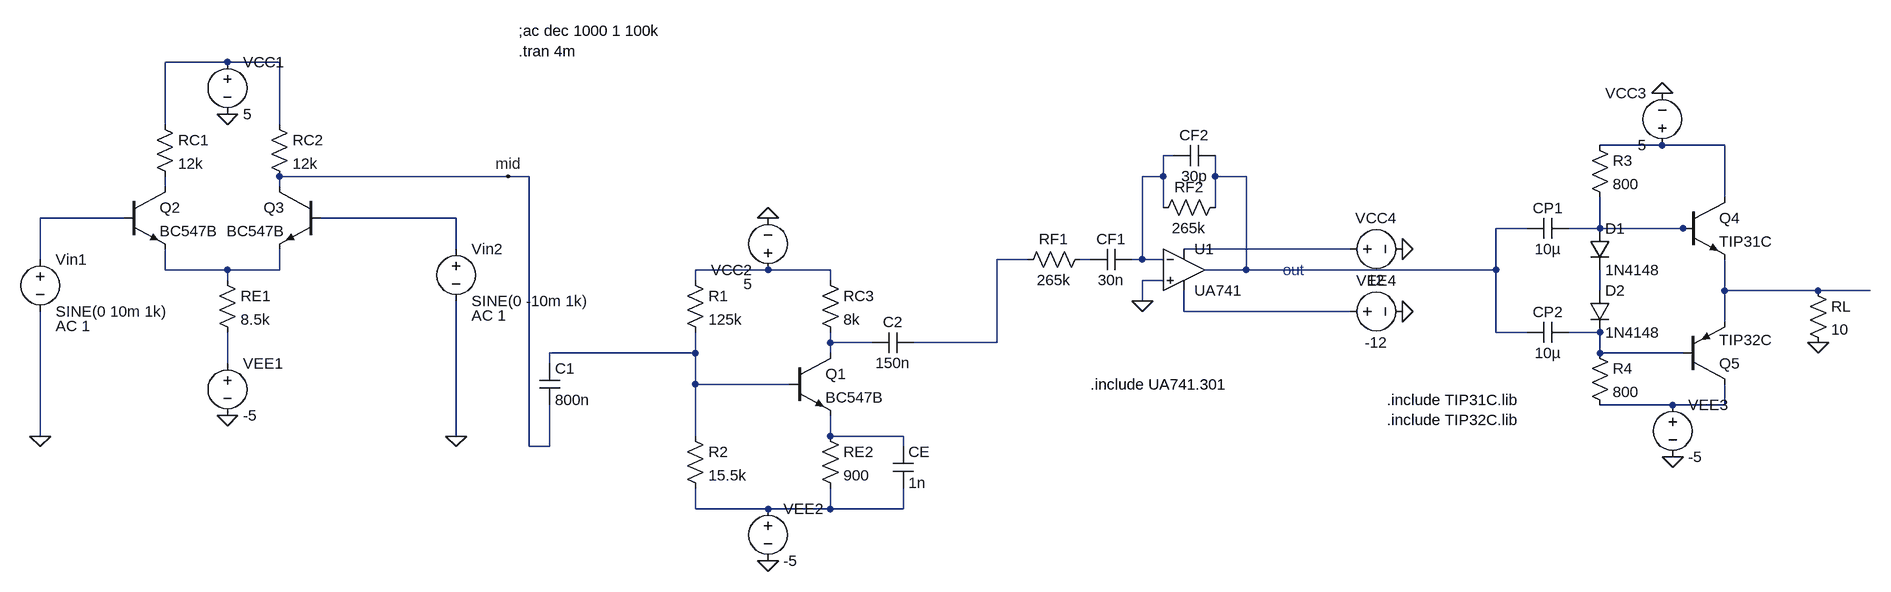
[diagram p0: schematic amp type1.asc]
amp type1.asc, the LTspice schematic file:
Version 4
SHEET 1 2036 680
WIRE -560 -208 -656 -208
WIRE -480 -208 -560 -208
WIRE -656 -112 -656 -208
WIRE -480 -112 -480 -208
WIRE 1648 -80 1552 -80
WIRE 1744 -80 1648 -80
WIRE 896 -64 880 -64
WIRE -128 -32 -480 -32
WIRE -96 -32 -128 -32
WIRE 880 -32 880 -64
WIRE 880 -32 848 -32
WIRE 960 -32 960 -64
WIRE 1008 -32 960 -32
WIRE -656 -16 -656 -32
WIRE -480 -16 -480 -32
WIRE 1744 0 1744 -80
WIRE 880 16 880 -32
WIRE 960 16 960 -32
WIRE -720 32 -848 32
WIRE -208 32 -416 32
WIRE 1440 48 1392 48
WIRE 1552 48 1552 0
WIRE 1552 48 1504 48
WIRE 1680 48 1552 48
WIRE 1696 48 1680 48
WIRE -208 80 -208 32
WIRE 1168 80 912 80
WIRE -848 96 -848 32
WIRE 672 96 624 96
WIRE 768 96 752 96
WIRE 848 96 848 -32
WIRE 848 96 832 96
WIRE 880 96 848 96
WIRE -656 112 -656 80
WIRE -560 112 -656 112
WIRE -480 112 -480 80
WIRE -480 112 -560 112
WIRE 272 112 160 112
WIRE 368 112 272 112
WIRE 1008 112 1008 -32
WIRE 1008 112 944 112
WIRE 1392 112 1392 48
WIRE 1392 112 1008 112
WIRE -560 128 -560 112
WIRE 160 128 160 112
WIRE 368 128 368 112
WIRE 880 128 848 128
WIRE 1552 144 1552 112
WIRE 1744 144 1744 96
WIRE 1888 144 1744 144
WIRE 1968 144 1888 144
WIRE 848 160 848 128
WIRE 912 176 912 144
WIRE 1168 176 912 176
WIRE 1744 192 1744 144
WIRE 1392 208 1392 112
WIRE 1440 208 1392 208
WIRE 1552 208 1504 208
WIRE 368 224 368 208
WIRE 432 224 368 224
WIRE 624 224 624 96
WIRE 624 224 496 224
WIRE 160 240 160 208
WIRE 160 240 -64 240
WIRE 368 240 368 224
WIRE 1552 240 1552 208
WIRE 1680 240 1552 240
WIRE -560 256 -560 208
WIRE -64 256 -64 240
WIRE 160 288 160 240
WIRE 304 288 160 288
WIRE 1664 320 1552 320
WIRE 1744 320 1744 288
WIRE 1744 320 1664 320
WIRE -848 368 -848 176
WIRE -208 368 -208 160
WIRE 160 368 160 288
WIRE 368 368 368 336
WIRE 480 368 368 368
WIRE -96 384 -96 -32
WIRE -64 384 -64 320
WIRE -64 384 -96 384
WIRE 480 384 480 368
WIRE 160 480 160 448
WIRE 272 480 160 480
WIRE 368 480 368 448
WIRE 368 480 272 480
WIRE 480 480 480 448
WIRE 480 480 368 480
FLAG 272 32 0
FLAG -848 368 0
FLAG -208 368 0
FLAG -560 336 0
FLAG -560 -128 0
FLAG -128 -32 mid
FLAG 848 160 0
FLAG 1248 80 0
FLAG 1248 176 0
FLAG 272 560 0
FLAG 1648 -160 0
FLAG 1888 224 0
FLAG 1664 400 0
SYMBOL npn 304 240 R0
SYMATTR InstName Q1
SYMATTR Value BC547B
SYMBOL res 352 112 R0
SYMATTR InstName RC3
SYMATTR Value 8k
SYMBOL res 144 112 R0
SYMATTR InstName R1
SYMATTR Value 125k
SYMBOL res 352 352 R0
SYMATTR InstName RE2
SYMATTR Value 900
SYMBOL res 144 352 R0
SYMATTR InstName R2
SYMATTR Value 15.5k
SYMBOL voltage 272 128 R180
WINDOW 3 24 -6 Left 2
SYMATTR Value 5
SYMATTR InstName VCC2
SYMBOL cap -80 256 R0
SYMATTR InstName C1
SYMATTR Value 800n
SYMBOL cap 464 384 R0
SYMATTR InstName CE
SYMATTR Value 1n
SYMBOL cap 496 208 R90
WINDOW 0 0 32 VBottom 2
WINDOW 3 32 32 VTop 2
SYMATTR InstName C2
SYMATTR Value 150n
SYMBOL res -672 -128 R0
SYMATTR InstName RC1
SYMATTR Value 12k
SYMBOL res -496 -128 R0
SYMATTR InstName RC2
SYMATTR Value 12k
SYMBOL voltage -560 -224 R0
WINDOW 123 0 0 Left 0
WINDOW 39 0 0 Left 0
SYMATTR InstName VCC1
SYMATTR Value 5
SYMBOL npn -720 -16 R0
SYMATTR InstName Q2
SYMATTR Value BC547B
SYMBOL res -576 112 R0
SYMATTR InstName RE1
SYMATTR Value 8.5k
SYMBOL voltage -848 80 R0
WINDOW 123 24 118 Left 2
WINDOW 39 0 0 Left 0
SYMATTR Value2 AC 1
SYMATTR InstName Vin1
SYMATTR Value SINE(0 10m 1k)
SYMBOL voltage -208 64 R0
WINDOW 123 24 118 Left 2
WINDOW 39 0 0 Left 0
SYMATTR Value2 AC 1
SYMATTR InstName Vin2
SYMATTR Value SINE(0 -10m 1k)
SYMBOL voltage -560 240 R0
WINDOW 123 0 0 Left 0
WINDOW 39 0 0 Left 0
SYMATTR InstName VEE1
SYMATTR Value -5
SYMBOL npn -416 -16 M0
SYMATTR InstName Q3
SYMATTR Value BC547B
SYMBOL opamp2 912 48 R0
SYMATTR InstName U1
SYMATTR Value UA741
SYMBOL res 768 80 R90
WINDOW 0 0 56 VBottom 2
WINDOW 3 32 56 VTop 2
SYMATTR InstName RF1
SYMATTR Value 265k
SYMBOL res 976 0 R90
WINDOW 0 0 56 VBottom 2
WINDOW 3 32 56 VTop 2
SYMATTR InstName RF2
SYMATTR Value 265k
SYMBOL cap 832 80 R90
WINDOW 0 0 32 VBottom 2
WINDOW 3 32 32 VTop 2
SYMATTR InstName CF1
SYMATTR Value 30n
SYMBOL cap 960 -80 R90
WINDOW 0 0 32 VBottom 2
WINDOW 3 32 32 VTop 2
SYMATTR InstName CF2
SYMATTR Value 30p
SYMBOL voltage 1152 80 R270
WINDOW 0 32 56 VTop 2
WINDOW 3 -32 56 VBottom 2
WINDOW 123 0 0 Left 0
WINDOW 39 0 0 Left 0
SYMATTR InstName VCC4
SYMATTR Value 12
SYMBOL voltage 1152 176 R270
WINDOW 0 32 56 VTop 2
WINDOW 3 -32 56 VBottom 2
WINDOW 123 0 0 Left 0
WINDOW 39 0 0 Left 0
SYMATTR InstName VEE4
SYMATTR Value -12
SYMBOL voltage 272 464 R0
WINDOW 123 0 0 Left 0
WINDOW 39 0 0 Left 0
SYMATTR InstName VEE2
SYMATTR Value -5
SYMBOL cap 1504 32 R90
WINDOW 0 0 32 VBottom 2
WINDOW 3 32 32 VTop 2
SYMATTR InstName CP1
SYMATTR Value 10µ
SYMBOL cap 1504 192 R90
WINDOW 0 0 32 VBottom 2
WINDOW 3 32 32 VTop 2
SYMATTR InstName CP2
SYMATTR Value 10µ
SYMBOL res 1536 -96 R0
SYMATTR InstName R3
SYMATTR Value 800
SYMBOL res 1536 224 R0
SYMATTR InstName R4
SYMATTR Value 800
SYMBOL npn 1680 0 R0
SYMATTR InstName Q4
SYMATTR Value TIP31C
SYMBOL pnp 1680 288 M180
SYMATTR InstName Q5
SYMATTR Value TIP32C
SYMBOL voltage 1664 304 R0
WINDOW 123 0 0 Left 0
WINDOW 39 0 0 Left 0
SYMATTR InstName VEE3
SYMATTR Value -5
SYMBOL diode 1536 48 R0
SYMATTR InstName D1
SYMATTR Value 1N4148
SYMBOL diode 1536 144 R0
SYMATTR InstName D2
SYMATTR Value 1N4148
SYMBOL res 1872 128 R0
SYMATTR InstName RL
SYMATTR Value 10
SYMBOL voltage 1648 -64 R180
WINDOW 0 24 96 Left 2
WINDOW 3 24 16 Left 2
SYMATTR InstName VCC3
SYMATTR Value 5
TEXT 768 288 Left 2 !.include UA741.301
TEXT 1064 112 Left 2 ;out
TEXT 1224 312 Left 2 !.include TIP31C.lib\n.include TIP32C.lib
TEXT -112 -256 Left 2 !;ac dec 1000 1 100k\n.tran 4m

The netlist it stands for:
* amp type1.asc
Q1 N018 N019 N022 0 BC547B
RC3 N013 N018 8k
R1 N013 N019 125k
RE2 N022 N023 900
R2 N019 N023 15.5k
VCC2 N013 0 5
C1 N019 mid 800n
CE N022 N023 1n
C2 N010 N018 150n
RC1 N001 N005 12k
RC2 N001 mid 12k
VCC1 N001 0 5
Q2 N005 N006 N012 0 BC547B
RE1 N012 N020 8.5k
Vin1 N006 0 SINE(0 10m 1k) AC 1
Vin2 N007 0 SINE(0 -10m 1k) AC 1
VEE1 N020 0 -5
Q3 mid N007 N012 0 BC547B
XU1 0 N003 N009 N016 N004 UA741  ; pins In+ In- V+ V- OUT
RF1 N011 N010 265k
RF2 N004 N003 265k
CF1 N003 N011 30n
CF2 N004 N003 30p
VCC4 N009 0 12
VEE4 N016 0 -12
VEE2 N023 0 -5
CP1 N008 N004 10µ
CP2 N017 N004 10µ
R3 N002 N008 800
R4 N017 N021 800
Q4 N002 N008 N015 0 TIP31C
Q5 N021 N017 N015 0 TIP32C
VEE3 N021 0 -5
D1 N008 N014 1N4148
D2 N014 N017 1N4148
RL N015 0 10
VCC3 N002 0 5
.model D D
.lib standard.dio
.model NPN NPN
.model PNP PNP
.lib standard.bjt
.include UA741.301
* out
.include TIP31C.lib
.include TIP32C.lib
;ac dec 1000 1 100k
.tran 4m
.backanno
.end